# Altium schematic sheet Sheet2.SCHDOC
size 421 x 298 mm; SheetNumber: 2; SheetTotal: 2; DocumentName: Sheet2.SCHDOC
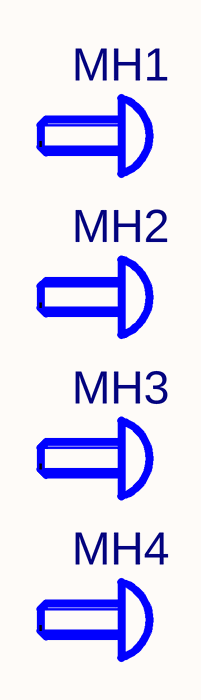
[diagram p0: Sheet2.SCHDOC]

## Parts
MH1  MH_M2.0_NONPLATED  [MH_M2.0_NONPLATED]  (value not drawn)
MH2  MH_M2.0_NONPLATED  [MH_M2.0_NONPLATED]  (value not drawn)
MH3  MH_M2.0_NONPLATED  [MH_M2.0_NONPLATED]  (value not drawn)
MH4  MH_M2.0_NONPLATED  [MH_M2.0_NONPLATED]  (value not drawn)

## Nets

Not connected (* = marked no-connect by the designer): MH1 1; MH2 1; MH3 1; MH4 1